# Altium schematic sheet Sensores.SchDoc
size A4
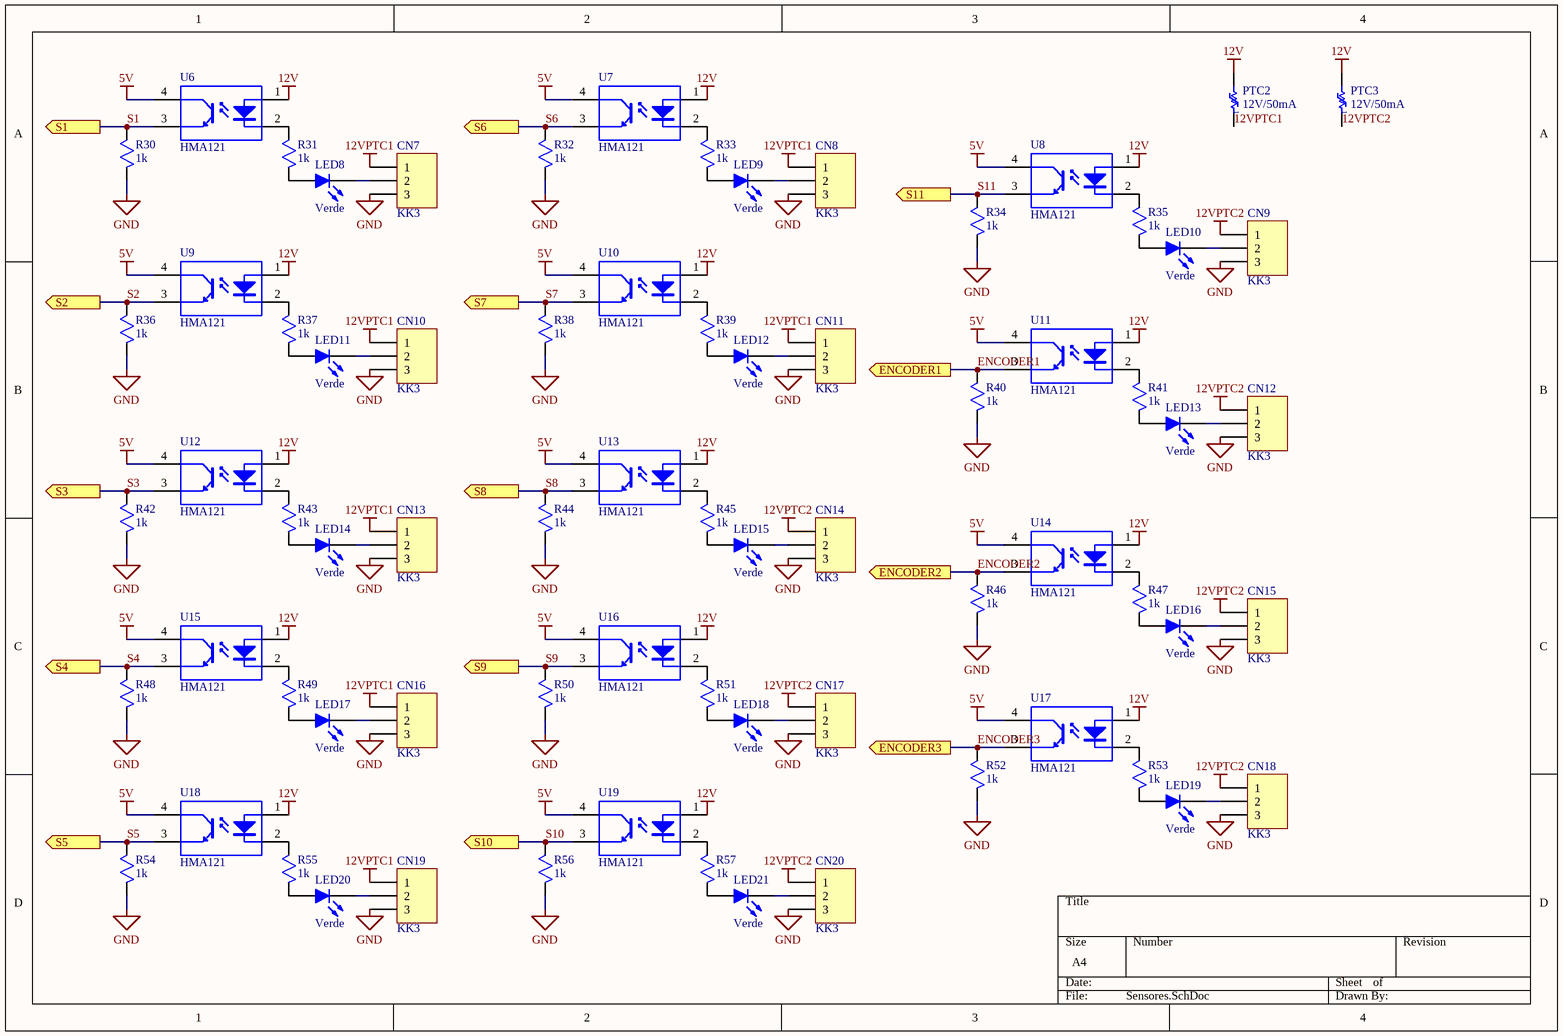
[diagram p0: Sensores.SchDoc]

## Parts
CN7  KK3  [KK3 - 2.54mm]
CN8  KK3  [KK3 - 2.54mm]
CN9  KK3  [KK3 - 2.54mm]
CN10  KK3  [KK3 - 2.54mm]
CN11  KK3  [KK3 - 2.54mm]
CN12  KK3  [KK3 - 2.54mm]
CN13  KK3  [KK3 - 2.54mm]
CN14  KK3  [KK3 - 2.54mm]
CN15  KK3  [KK3 - 2.54mm]
CN16  KK3  [KK3 - 2.54mm]
CN17  KK3  [KK3 - 2.54mm]
CN18  KK3  [KK3 - 2.54mm]
CN19  KK3  [KK3 - 2.54mm]
CN20  KK3  [KK3 - 2.54mm]
LED8  Verde  [LED_SMD_0805]
LED9  Verde  [LED_SMD_0805]
LED10  Verde  [LED_SMD_0805]
LED11  Verde  [LED_SMD_0805]
LED12  Verde  [LED_SMD_0805]
LED13  Verde  [LED_SMD_0805]
LED14  Verde  [LED_SMD_0805]
LED15  Verde  [LED_SMD_0805]
LED16  Verde  [LED_SMD_0805]
LED17  Verde  [LED_SMD_0805]
LED18  Verde  [LED_SMD_0805]
LED19  Verde  [LED_SMD_0805]
LED20  Verde  [LED_SMD_0805]
LED21  Verde  [LED_SMD_0805]
PTC2  12V/50mA  [PTC-200]
PTC3  12V/50mA  [PTC-200]
R30  1k  [SMD0805]
R31  1k  [SMD0805]
R32  1k  [SMD0805]
R33  1k  [SMD0805]
R34  1k  [SMD0805]
R35  1k  [SMD0805]
R36  1k  [SMD0805]
R37  1k  [SMD0805]
R38  1k  [SMD0805]
R39  1k  [SMD0805]
R40  1k  [SMD0805]
R41  1k  [SMD0805]
R42  1k  [SMD0805]
R43  1k  [SMD0805]
R44  1k  [SMD0805]
R45  1k  [SMD0805]
R46  1k  [SMD0805]
R47  1k  [SMD0805]
R48  1k  [SMD0805]
R49  1k  [SMD0805]
R50  1k  [SMD0805]
R51  1k  [SMD0805]
R52  1k  [SMD0805]
R53  1k  [SMD0805]
R54  1k  [SMD0805]
R55  1k  [SMD0805]
R56  1k  [SMD0805]
R57  1k  [SMD0805]
U6  HMA121  [SO4]
U7  HMA121  [SO4]
U8  HMA121  [SO4]
U9  HMA121  [SO4]
U10  HMA121  [SO4]
U11  HMA121  [SO4]
U12  HMA121  [SO4]
U13  HMA121  [SO4]
U14  HMA121  [SO4]
U15  HMA121  [SO4]
U16  HMA121  [SO4]
U17  HMA121  [SO4]
U18  HMA121  [SO4]
U19  HMA121  [SO4]

## Ports
ENCODER1 (out), ENCODER2 (out), ENCODER3 (out), S1 (out), S2 (out), S3 (out), S4 (out), S5 (out), S6 (out), S7 (out), S8 (out), S9 (out), S10 (out), S11 (out)

## Nets
5V: U6.4(C) U7.4(C) U8.4(C) U9.4(C) U10.4(C) U11.4(C) U12.4(C) U13.4(C) U14.4(C) U15.4(C) U16.4(C) U17.4(C) U18.4(C) U19.4(C)
12V: PTC2.2 PTC3.2 U6.1(A) U7.1(A) U8.1(A) U9.1(A) U10.1(A) U11.1(A) U12.1(A) U13.1(A) U14.1(A) U15.1(A) U16.1(A) U17.1(A) U18.1(A) U19.1(A)
12VPTC1: CN7.1 CN8.1 CN10.1 CN11.1 CN13.1 CN16.1 CN19.1 PTC2.1
12VPTC2: CN9.1 CN12.1 CN14.1 CN15.1 CN17.1 CN18.1 CN20.1 PTC3.1
GND: CN7.3 CN8.3 CN9.3 CN10.3 CN11.3 CN12.3 CN13.3 CN14.3 CN15.3 CN16.3 CN17.3 CN18.3 CN19.3 CN20.3 R30.2 R32.2 R34.2 R36.2 R38.2 R40.2 R42.2 R44.2 R46.2 R48.2 R50.2 R52.2 R54.2 R56.2
ENCODER1: R40.1 U11.3(E) ; port ENCODER1
ENCODER2: R46.1 U14.3(E) ; port ENCODER2
ENCODER3: R52.1 U17.3(E) ; port ENCODER3
S1: R30.1 U6.3(E) ; port S1
S2: R36.1 U9.3(E) ; port S2
S3: R42.1 U12.3(E) ; port S3
S4: R48.1 U15.3(E) ; port S4
S5: R54.1 U18.3(E) ; port S5
S6: R32.1 U7.3(E) ; port S6
S7: R38.1 U10.3(E) ; port S7
S8: R44.1 U13.3(E) ; port S8
S9: R50.1 U16.3(E) ; port S9
S10: R56.1 U19.3(E) ; port S10
S11: R34.1 U8.3(E) ; port S11
NetCN7_2: CN7.2 LED8.2(K)
NetCN8_2: CN8.2 LED9.2(K)
NetCN9_2: CN9.2 LED10.2(K)
NetCN10_2: CN10.2 LED11.2(K)
NetCN11_2: CN11.2 LED12.2(K)
NetCN12_2: CN12.2 LED13.2(K)
NetCN13_2: CN13.2 LED14.2(K)
NetCN14_2: CN14.2 LED15.2(K)
NetCN15_2: CN15.2 LED16.2(K)
NetCN16_2: CN16.2 LED17.2(K)
NetCN17_2: CN17.2 LED18.2(K)
NetCN18_2: CN18.2 LED19.2(K)
NetCN19_2: CN19.2 LED20.2(K)
NetCN20_2: CN20.2 LED21.2(K)
NetLED8_1: LED8.1(A) R31.1
NetLED9_1: LED9.1(A) R33.1
NetLED10_1: LED10.1(A) R35.1
NetLED11_1: LED11.1(A) R37.1
NetLED12_1: LED12.1(A) R39.1
NetLED13_1: LED13.1(A) R41.1
NetLED14_1: LED14.1(A) R43.1
NetLED15_1: LED15.1(A) R45.1
NetLED16_1: LED16.1(A) R47.1
NetLED17_1: LED17.1(A) R49.1
NetLED18_1: LED18.1(A) R51.1
NetLED19_1: LED19.1(A) R53.1
NetLED20_1: LED20.1(A) R55.1
NetLED21_1: LED21.1(A) R57.1
NetR31_2: R31.2 U6.2(K)
NetR33_2: R33.2 U7.2(K)
NetR35_2: R35.2 U8.2(K)
NetR37_2: R37.2 U9.2(K)
NetR39_2: R39.2 U10.2(K)
NetR41_2: R41.2 U11.2(K)
NetR43_2: R43.2 U12.2(K)
NetR45_2: R45.2 U13.2(K)
NetR47_2: R47.2 U14.2(K)
NetR49_2: R49.2 U15.2(K)
NetR51_2: R51.2 U16.2(K)
NetR53_2: R53.2 U17.2(K)
NetR55_2: R55.2 U18.2(K)
NetR57_2: R57.2 U19.2(K)

## Library data of the parts
CN7-CN20 = KK3: Conector Linear tipo KK de 3 vias
LED8-LED21 = Led: Manufacturer: Generic Components; Class I: Optoelectronic; Published: 8-Jun-2000; Revision: July-2002: Re-released for DXP Platform.; Publisher: Altium Limited; Class II: LED
PTC2 PTC3 = PTC: Termistor; Class I: Passive; Class II: Resistor; Revision: July-2002: Re-released for DXP Platform.; Value: *
R30-R57 = Resistor
U6-U19 = HMA: Phototransistor Optocoupler SMD full Pptch mini-flat type; Manufacturer: Generic Components; Class I: Optoelectronic; Published: 24-Mar-1999; Revision: July-2002: Re-released for DXP Platform.; Publisher: Altium Limited